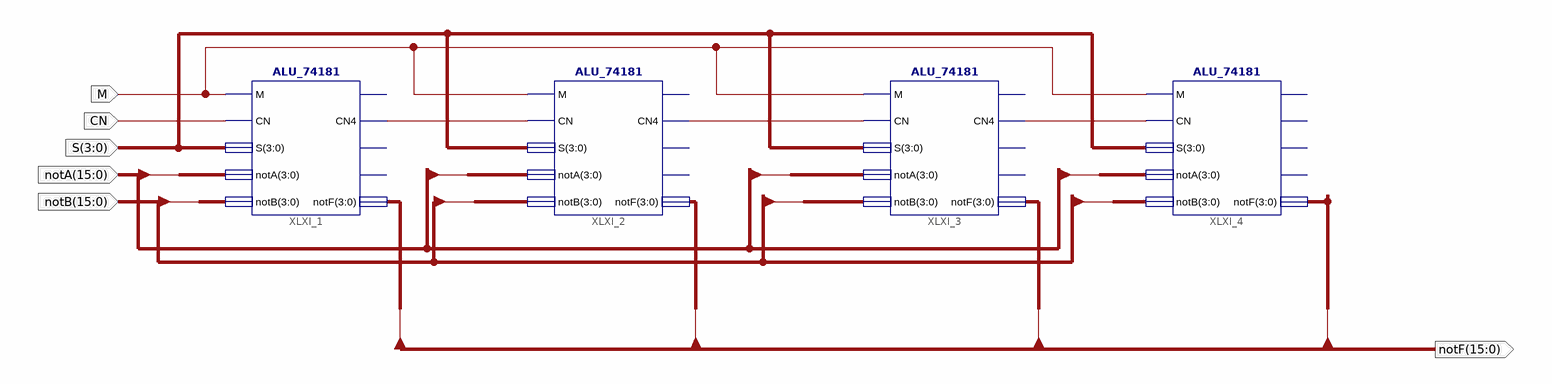
[diagram p0: schematic sheet 1]
// Xilinx ISE schematic ALU_UNIT.sch (spartan3a) as structural Verilog: 4 symbols, 6 ports
module ALU_UNIT (
  input  M,
  input  CN,
  input  [3:0] S,
  input  [15:0] notA,
  input  [15:0] notB,
  output [15:0] notF
);

  wire XLXN_1, XLXN_2, XLXN_3;

  ALU_74181 XLXI_1 (
    .M(M), .CN(CN), .S(S), .notA(notA[3:0]), .notB(notB[3:0]), .CN4(XLXN_1), .notF(notF[3:0]));  // open: AEQB, notP, notG
  ALU_74181 XLXI_2 (
    .M(M), .CN(XLXN_1), .S(S), .notA(notA[7:4]), .notB(notB[7:4]), .CN4(XLXN_2), .notF(notF[7:4]));  // open: AEQB, notP, notG
  ALU_74181 XLXI_3 (
    .M(M), .CN(XLXN_2), .S(S), .notA(notA[11:8]), .notB(notB[11:8]), .CN4(XLXN_3), .notF(notF[11:8]));  // open: AEQB, notP, notG
  ALU_74181 XLXI_4 (
    .M(M), .CN(XLXN_3), .S(S), .notA(notA[15:12]), .notB(notB[15:12]), .notF(notF[15:12]));  // open: AEQB, CN4, notP, notG
endmodule
